# EasyEDA Pro project Address Buffer 0.2.eprj

# Schematic Schematic1
Board Name: Board1; Create Date: 2026-05-03; Page Name: P1; Project Name: Address Buffer 0.2; Schematic Name: Schematic1; Update Date: 2026-05-03; Company: EasyEDA.com; Page Size: A4; Version: V1.0
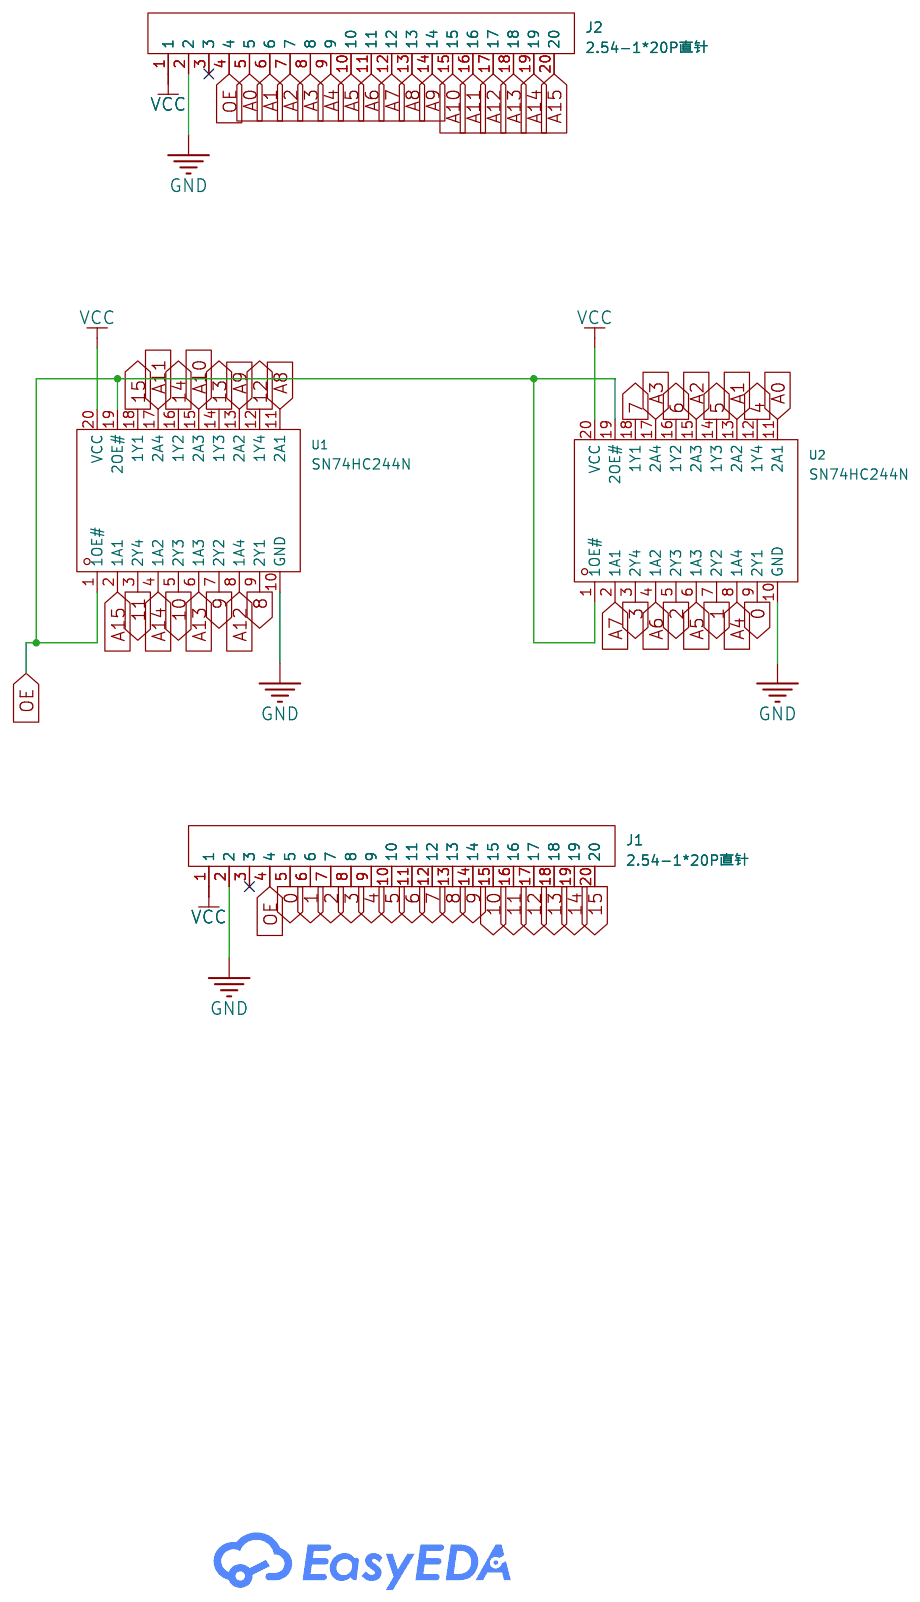
[diagram p0: schematic sheet]

## Parts
J1  2.54-1*20P直针  [HDR-TH_20P-P2.54-V-M-1]
J2  2.54-1*20P直针  [HDR-TH_20P-P2.54-V-M-1]
U1  SN74HC244N  [DIP-20_L26.8-W6.4-P2.54-LS7.6-BL]
U2  SN74HC244N  [DIP-20_L26.8-W6.4-P2.54-LS7.6-BL]

## Library data of the parts
J1 J2 = 2.54-1*20P直针: LCSC Part Name: 1x20P 间距:2.54mm 方针 直插; Supplier Part: C50981; Manufacturer: BOOMELE(博穆精密); Supplier Footprint: 插件,P=2.54mm; JLCPCB Part Class: Extended Part; Datasheet: https://item.szlcsc.com/datasheet/2.54-1*20P%25E7%259B%25B4%25E9%2592%2588/51993.html; Supplier: LCSC; Pin Structure: 1x20P; Pitch: 2.54mm; Circluar Pins/Square Pins: Pin Header; Mounting Type: Through Hole; Number of Rows: 1; Number of Pins: 20P; Current Rating: 3A; Contact Material: Brass; Operating Temperature: -40℃~+105℃; Color: Black
U1 U2 = SN74HC244N: LCSC Part Name: 八进制缓冲器和带三态输出的线路驱动器; Supplier Part: C2912; Manufacturer: TI(德州仪器); Supplier Footprint: DIP-20; JLCPCB Part Class: Extended Part; Datasheet: https://www.ti.com/cn/lit/gpn/sn74hc244; Supplier: LCSC; output type: Tri-State; Voltage - Supply: 2V~6V; Number of Elements: 2; Number of Bits per Element: 4; Channel Type: Unidirectional; Current - Output Low(IOL): 7.8mA; Current - Output High(IOH): 7.8mA; Logic Family: 74HC; Operating Temperature: -40℃~+85℃; Quiescent Current: 80uA; Propagation Delay: 11ns@6V,50pF

## Nets
GND: J1.2 J2.2 U1.10(GND) U2.10(GND)
VCC: J1.1 J2.1 U1.20(VCC) U2.20(VCC)
0: J1.5 U2.9(2Y1)
1: J1.6 U2.7(2Y2)
2: J1.7 U2.5(2Y3)
3: J1.8 U2.3(2Y4)
4: J1.9 U2.12(1Y4)
5: J1.10 U2.14(1Y3)
6: J1.11 U2.16(1Y2)
7: J1.12 U2.18(1Y1)
8: J1.13 U1.9(2Y1)
9: J1.14 U1.7(2Y2)
10: J1.15 U1.5(2Y3)
11: J1.16 U1.3(2Y4)
12: J1.17 U1.12(1Y4)
13: J1.18 U1.14(1Y3)
14: J1.19 U1.16(1Y2)
15: J1.20 U1.18(1Y1)
A0: J2.5 U2.11(2A1)
A1: J2.6 U2.13(2A2)
A2: J2.7 U2.15(2A3)
A3: J2.8 U2.17(2A4)
A4: J2.9 U2.8(1A4)
A5: J2.10 U2.6(1A3)
A6: J2.11 U2.4(1A2)
A7: J2.12 U2.2(1A1)
A8: J2.13 U1.11(2A1)
A9: J2.14 U1.13(2A2)
A10: J2.15 U1.15(2A3)
A11: J2.16 U1.17(2A4)
A12: J2.17 U1.8(1A4)
A13: J2.18 U1.6(1A3)
A14: J2.19 U1.4(1A2)
A15: J2.20 U1.2(1A1)
OE: J1.4 J2.4 U1.1(1OE#) U1.19(2OE#) U2.1(1OE#) U2.19(2OE#)

Not connected (* = marked no-connect by the designer): J1 3*; J2 3*

# Board PCB1
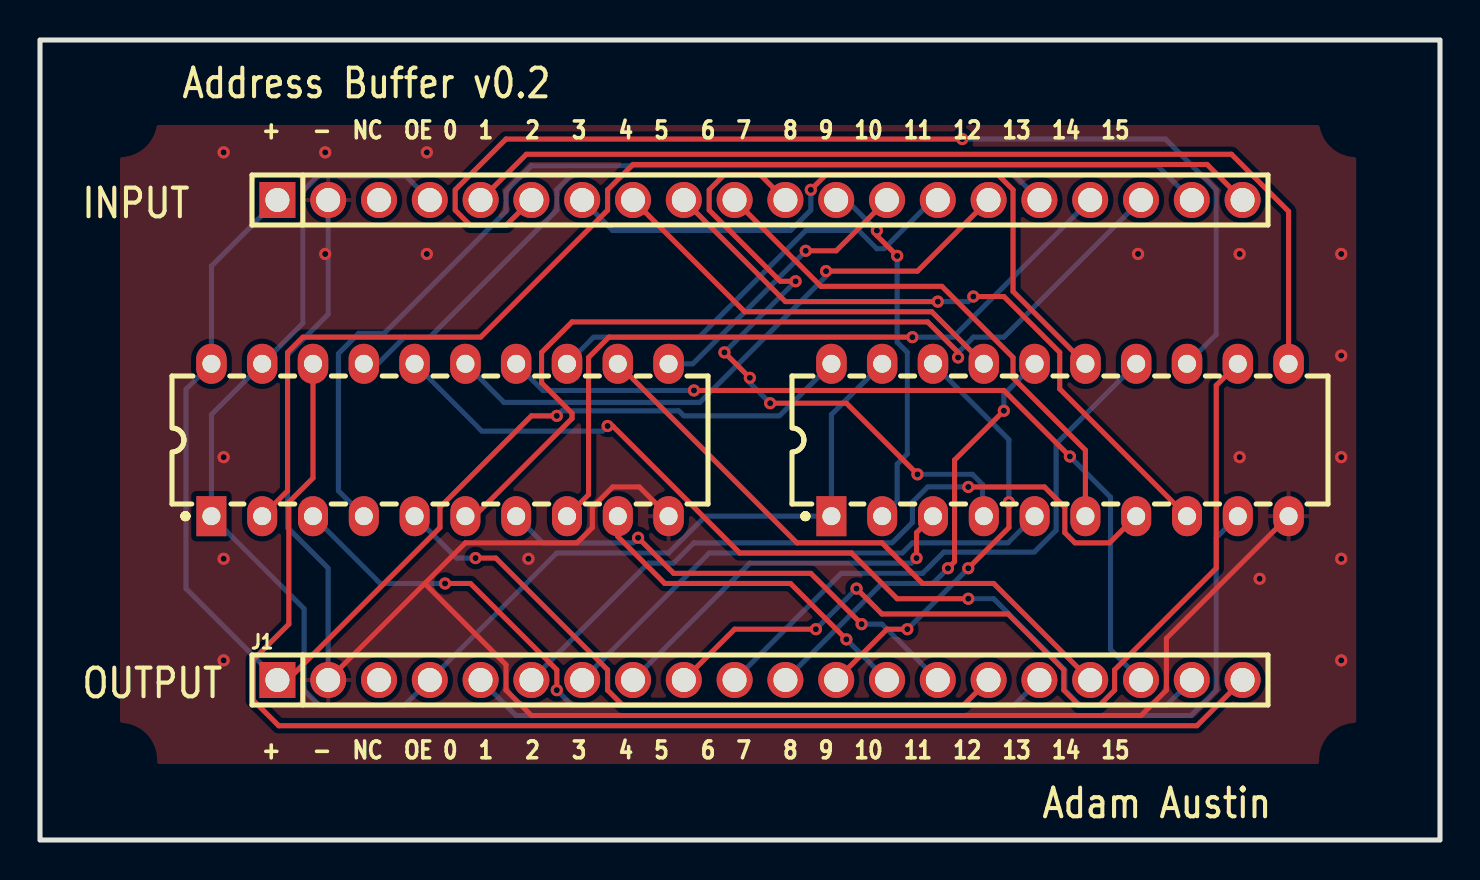
[diagram p1: board, top side]
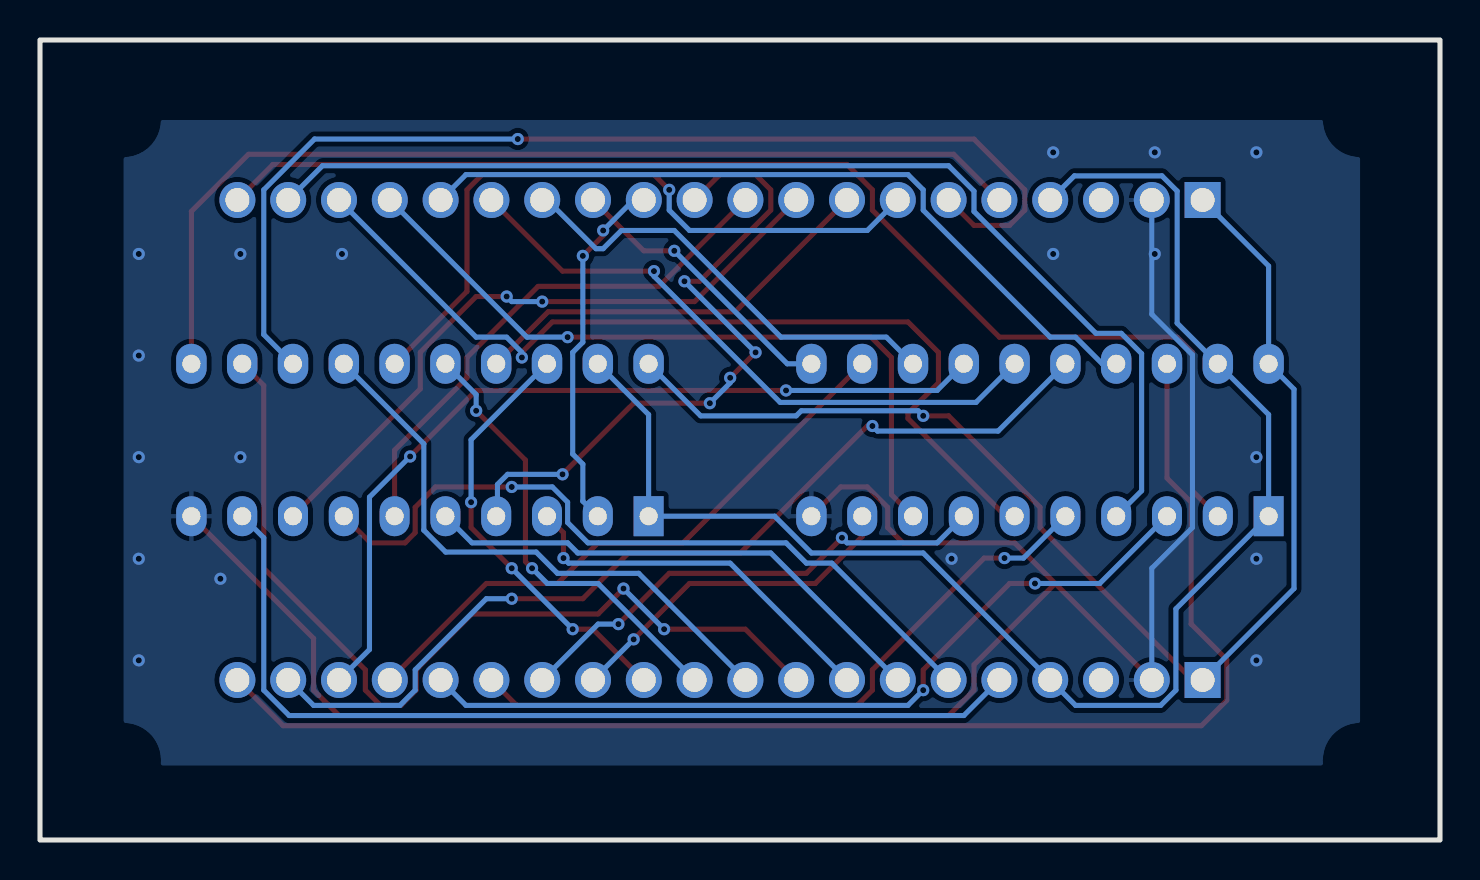
[diagram p2: board, bottom side, seen from below]

Outline 70 x 40 mm; copper layers: Top Layer, Bottom Layer. Coordinates in mm from the lower left corner of the outline.
Outline path: rectangle 0,40 70,0
Stack: Top Layer 0.035mm / Dielectric1 1.51mm FR4 er 4.5 / Bottom Layer 0.035mm

## Design rules (mm)
template: JLCPCB Capability(Two Layers Board)
spacing copperThickness1oz (default): track to track 0.102, other pairs 0.152 to 0.3
spacing copperThickness2oz: track to track 0.203, other pairs 0.152 to 0.3
track width copperThickness1oz (default): min 0.127, default 0.254, max 2.54
track width copperThickness2oz: min 0.203, default 0.254, max 2.54
differential pair differentialPair (default): width min 0.127, default 0.254, max 2.54; gap min 0.152, default 0.152
via viaSize (default): diameter min 0.5, default 0.61, max 10; hole min 0.3, default 0.305, max 6.3

## Placement (name value [footprint] x y rotation side)
J1  2.54-1*20P直针  [HDR-TH_20P-P2.54-V-M-1]  36 8 0 top
J2  2.54-1*20P直针  [HDR-TH_20P-P2.54-V-M-1]  36 32 0 top
U1  SN74HC244N  [DIP-20_L26.8-W6.4-P2.54-LS7.6-BL]  20 20 0 top
U2  SN74HC244N  [DIP-20_L26.8-W6.4-P2.54-LS7.6-BL]  51 20 0 top

## Footprints (pads in the part's own frame, mm; a bottom-side part is the same pattern mirrored in y, then rotated)
DIP-20_L26.8-W6.4-P2.54-LS7.6-BL
  rect 1.5x2 hole 0.9: 1(-11.43,-3.81)
  oval 1.5x2 hole 0.9: 2(-8.89,-3.81) 3(-6.35,-3.81) 4(-3.81,-3.81) 5(-1.27,-3.81) 6(1.27,-3.81) 7(3.81,-3.81) 8(6.35,-3.81) 9(8.89,-3.81)
  oval 1.524x2 hole 0.9: 10(11.43,-3.81) 11(11.43,3.81) 12(8.89,3.81) 13(6.35,3.81) 14(3.81,3.81) 15(1.27,3.81) 16(-1.27,3.81) 17(-3.81,3.81) 18(-6.35,3.81) 19(-8.89,3.81) 20(-11.43,3.81)
HDR-TH_20P-P2.54-V-M-1
  rect 1.8x1.8 hole 1.2: 1(-24.13,0)
  round 1.8 hole 1.2: 2(-21.59,0) 3(-19.05,0) 4(-16.51,0) 5(-13.97,0) 6(-11.43,0) 7(-8.89,0) 8(-6.35,0) 9(-3.81,0) 10(-1.27,0) 11(1.27,0) 12(3.81,0) 13(6.35,0) 14(8.89,0) 15(11.43,0) 16(13.97,0) 17(16.51,0) 18(19.05,0) 19(21.59,0) 20(24.13,0)

## Nets
As in the schematic.

Pads without a net: J1 3; J2 3

## Via types
v1: diameter 0.61, hole 0.305, Top Layer to Bottom Layer, 53 vias

## Routing (per net, layer and track width the routed paths; a pad name or vN(x,y) marks a point on that pad's centre or on a via; arc(x,y) is an arc through that point)
GND: length 100.2
  Top Layer w0.254: J1.2 19.24,12.83 ; 19.24,12.83 21.27,14.86 26.86,14.86 27.62,15.62 27.62,16.64 28.63,17.65 29.97,17.65 U1.10 ; 19.24,12.83 23.3,8.76 23.3,7.49 24.57,6.22 55.05,6.22 56.32,7.49 56.32,10.08 U2.10
  Bottom Layer w0.254: J1.2 14.41,13.59 12.38,15.62 12.38,24.26 14.41,26.29 J2.2
  vias: v1(9.18,34.38) v1(9.18,19.14) v1(9.18,14.06) v1(9.18,8.98) v1(14.26,34.38) v1(14.26,29.3) v1(19.34,34.38) v1(19.34,29.3) v1(24.42,14.06) v1(54.9,29.3) v1(59.98,29.3) v1(59.98,19.14) v1(60.98,13.06) v1(65.06,29.3) v1(65.06,24.22) v1(65.06,19.14) v1(65.06,14.06) v1(65.06,8.98)
VCC: length 62.8
  Top Layer w0.254: J1.1 12.38,8 20,15.62 20,16.64 24.57,21.21 v1(25.84,21.21)
  Bottom Layer w0.254: U2.20 36.97,21.21 32.19,21.21 31.94,21.46 26.09,21.46 v1(25.84,21.21) ; J2.1 8.57,28.7 U1.20 7.3,22.54 7.3,12.57 J1.1
0: length 47.2
  Bottom Layer w0.254: J1.5 23.81,6.22 57.54,6.22 58.81,7.49 58.81,15.11 U2.9
1: length 37.3
  Top Layer w0.254: U2.7 53.48,14.86 51.75,14.86 51.24,15.37 51.24,16.64 50.22,17.65 v1(46.41,17.65)
  Bottom Layer w0.254: v1(46.41,17.65) 44.38,17.65 43.62,16.89 43.62,15.87 42.6,14.86 32.7,14.86 31.68,13.84 30.41,13.84 J1.6
2: length 26
  Bottom Layer w0.254: J1.7 33.46,14.35 43.11,14.35 43.62,14.86 48.4,14.86 U2.5
3: length 19.1
  Top Layer w0.254: v1(43.83,14.1) 43.83,15.37 U2.3
  Bottom Layer w0.254: v1(43.83,14.1) 43.57,13.84 35.49,13.84 J1.8
4: length 45.6
  Top Layer w0.254: J1.9 34.73,10.54 v1(38.79,10.54) ; v1(40.83,12.57) 42.1,11.3 48.4,11.3 51.19,8.51 51.19,7.49 51.95,6.73 52.97,6.73 53.73,7.49 53.73,8.51 58.81,13.59 58.81,22.73 U2.12
  Bottom Layer w0.254: v1(38.79,10.54) v1(40.83,12.57)
5: length 29.2
  Bottom Layer w0.254: U2.14 50.81,19.81 50.81,15.49 49.72,14.4 45.19,14.4 44.13,13.33 40.06,13.33 J1.10
6: length 22.5
  Top Layer w0.254: v1(45.4,13.59) 45.73,13.92 45.73,19 v1(48.19,21.46)
  Bottom Layer w0.254: U2.16 48.19,22.27 v1(48.19,21.46) ; v1(45.4,13.59) 44.64,12.83 42.1,12.83 J1.11
7: length 21.6
  Top Layer w0.254: v1(46.41,13.59) 48.45,15.62 v1(48.45,16.89) ; J1.12 42.35,10.54 v1(43.37,10.54)
  Bottom Layer w0.254: U2.18 48.45,20.01 v1(48.45,16.89) ; v1(43.37,10.54) v1(46.41,13.59)
8: length 17.4
  Top Layer w0.254: U1.9 28.89,15.17 31.24,12.83 37.52,12.83 v1(40.32,10.03)
  Bottom Layer w0.254: J1.13 v1(40.32,10.03)
9: length 24.7
  Top Layer w0.254: v1(29.9,15.11) 31.68,13.33 38.54,13.33 v1(41.08,10.79)
  Bottom Layer w0.254: v1(29.9,15.11) 29.65,14.86 25.14,14.86 U1.7 ; J1.14 42.1,10.79 v1(41.08,10.79)
10: length 33.7
  Top Layer w0.254: J1.15 46.16,6.73 29.14,6.73 28.38,7.49 28.38,8.51 22.79,14.1 v1(21.78,14.1)
  Bottom Layer w0.254: U1.5 20.82,14.1 v1(21.78,14.1)
11: length 41.4
  Top Layer w0.254: v1(20.25,12.83) 21.52,12.83 25.84,8.51 v1(25.84,7.49)
  Bottom Layer w0.254: v1(25.84,7.49) 26.6,6.73 48.7,6.73 J1.16 ; U1.3 17.01,12.83 v1(20.25,12.83)
12: length 30.2
  Top Layer w0.254: U1.12 37.84,14.86 42.1,14.86 44.13,12.83 47.68,12.83 J1.17
13: length 42.3
  Top Layer w0.254: v1(51.49,19.18) 48.19,22.48 v1(32.7,22.48)
  Bottom Layer w0.254: U1.14 25.14,22.48 v1(32.7,22.48) ; J1.18 53.53,9.52 53.53,17.14 v1(51.49,19.18)
14: length 47.3
  Top Layer w0.254: v1(28.38,20.7) 28.63,20.7 34.98,14.35 40.57,14.35 42.86,12.06 v1(46.41,12.06)
  Bottom Layer w0.254: J1.19 56.32,6.73 52,6.73 51.24,7.49 51.24,8.51 47.68,12.06 v1(46.41,12.06) ; U1.16 22.09,20.45 28.13,20.45 v1(28.38,20.7)
15: length 69
  Top Layer w0.254: J1.20 57.84,5.71 11.93,5.71 10.66,6.98 10.66,9.02 12.44,10.79 12.44,16.89 13.65,18.1 U1.18
A0: length 50.1
  Top Layer w0.254: U2.11 62.43,31.43 59.57,34.29 24.32,34.29 J2.5
A1: length 55.1
  Top Layer w0.254: v1(46.11,35.05) 23.3,35.05 20.76,32.51 20.76,31.49 21.52,30.73 23.3,30.73 J2.6
  Bottom Layer w0.254: U2.13 58.81,25.27 58.81,32.51 56.27,35.05 v1(46.11,35.05)
A2: length 34.4
  Top Layer w0.254: v1(38.54,32.51) 39.3,33.27 47.89,33.27 48.65,32.51 48.65,27.43 U2.15
  Bottom Layer w0.254: v1(38.54,32.51) 38.54,31.49 37.52,30.48 28.63,30.48 J2.7
A3: length 20.9
  Top Layer w0.254: J2.8 35.24,26.41 44.59,26.41 U2.17
A4: length 33
  Top Layer w0.254: v1(44.89,26.92) 37.27,26.92 J2.9 ; v1(46.67,27.17) 48.19,27.17 50.99,24.38 50.99,22.55 U2.8
  Bottom Layer w0.254: v1(44.89,26.92) 46.41,26.92 v1(46.67,27.17)
A5: length 26.6
  Top Layer w0.254: U2.6 52.27,19.49 48.65,23.11 48.65,24.13 45.1,27.68 39.05,27.68 J2.10
A6: length 33.9
  Top Layer w0.254: v1(37.78,27.94) 37.02,27.94 33.46,31.49 33.46,32.51 34.22,33.27 36,33.27 J2.11 ; v1(43.87,18.28) 40.32,21.84 v1(36.51,21.84) ; v1(34.22,24.38) v1(35.49,23.11)
  Bottom Layer w0.254: v1(37.78,27.94) v1(34.22,24.38) ; U2.4 47.13,16.25 47.13,17.78 46.62,18.28 v1(43.87,18.28) ; v1(35.49,23.11) 35.49,22.86 v1(36.51,21.84)
A7: length 18.1
  Top Layer w0.254: v1(42.86,29.21) 41.84,30.22 v1(41.84,30.48)
  Bottom Layer w0.254: U2.2 42.86,16.94 42.86,18.79 43.37,19.3 43.37,24.38 42.86,24.89 v1(42.86,29.21) ; v1(41.84,30.48) 40.32,32 J2.12
A8: length 14.3
  Top Layer w0.254: J2.13 39.81,29.46 v1(38.29,29.46)
  Bottom Layer w0.254: U1.11 32.64,23.81 v1(38.29,29.46)
A9: length 22.7
  Bottom Layer w0.254: J2.14 44.64,32 42.2,29.56 41.84,29.56 40.93,30.48 38.29,30.48 32.95,25.14 27.68,25.14 U1.13
A10: length 31.3
  Top Layer w0.254: v1(39.3,28.44) 43.87,28.44 J2.15
  Bottom Layer w0.254: U1.15 23.2,21.88 32.99,21.88 39.3,28.19 v1(39.3,28.44)
A11: length 38.8
  Bottom Layer w0.254: U1.17 16.89,23.81 18.22,25.14 19.49,25.14 25.84,31.49 25.84,32.51 26.6,33.27 48.7,33.27 J2.16
A12: length 36.7
  Top Layer w0.254: v1(43.62,25.14) 28.44,25.14 27.43,24.13 27.43,17.27 U1.8
  Bottom Layer w0.254: J2.17 45.65,25.14 v1(43.62,25.14)
A13: length 46.2
  Top Layer w0.254: U1.6 21.33,16.25 21.78,16.25 26.6,21.08 26.6,21.33 25.08,22.86 25.08,24.38 26.6,25.9 44.38,25.9 45.91,24.38 v1(45.91,24.13)
  Bottom Layer w0.254: J2.18 48.19,25.14 46.67,25.14 45.91,24.38 v1(45.91,24.13)
A14: length 56.5
  Bottom Layer w0.254: J2.19 55.88,33.71 24.57,33.71 23.3,32.44 23.3,31.43 17.21,25.33 15.94,25.33 14.92,24.32 14.92,17.46 U1.4
A15: length 61.7
  Top Layer w0.254: U1.2 12.38,17.46 12.38,24.38 13.14,25.14 22.03,25.14 28.38,31.49 28.38,32.51 29.65,33.78 58.35,33.78 J2.20
OE: length 75.2
  Bottom Layer w0.254: U2.19 39.57,21.27 U2.1 33.27,16.19 31.43,14.35 25.84,14.35 J1.4 18.22,6.73 13.97,6.73 13.2,7.49 13.2,11.56 U1.1 8.57,21.27 U1.19 13.14,25.84 13.14,32.45 13.9,33.21 18.28,33.21 J2.4

## Copper pours and planes (outline as drawn; the poured copper is in the pictures)
GND on Top Layer: 4,35.75 65.81,35.75 65.81,3.8 4,3.8
GND on Bottom Layer: 4,36 65.81,36 65.81,3.72 4,3.72
GND on Bottom Layer: 4,36 65.81,36 65.81,4 4,4

## Text on the board
Top Silkscreen Layer: +   -  NC  OE 0  1   2   3   4  5   6  7   8  9  10  11  12  13  14  15 | INPUT | OUTPUT | Address Buffer v0.2 | Adam Austin
